# Altium schematic sheet Bioscope-Input-01.SchDoc
size 297 x 209 mm; SheetNumber: 1; SheetTotal: 1; ProjectTitle: Bioscope Input Stage; ProjectNumber: 01; Authors: Olivia De Vincenti; ProjectRevision: 01; SPICEModelCacheQIJVSJLZ: <root> / <DocumentId>QIJVSJLZ</DocumentId> / <CacheFrame Number="0"> / <Model Name="lm833" Kind="CKT"> / <Text>*LM833 OPERATIONAL AMPLIFIER "MACROMODEL" SUBCIRCUIT / * Connections: / *              Non-Inverting Input / *              | Inverting Input / *              | | Positive Power Supply / *              | | | Negative Power Supply / *              | | | | Output / *              | | | | | / .SUBCKT LM833  1 2 3 4 5 / C1   11 12 3.501E-12 / C2    6  7 10.00E-12 / DC    5 53 DX / DE   54  5 DX / DLP  90 91 DX / DLN  92 90 DX / DP    4  3 DX / EGND 99  0 POLY(2) (3,0) (4,0) 0 .5 .5 / FB    7 99 POLY(5) VB VC VE VLP VLN 0 27.96E6 / + -30E6 30E6 30E6 -30E6 / GA    6  0 11 12 565.5E-6 / GCM   0  6 10 99 5.655E-9 / ISS  10  4 DC 70.00E-6 / HLIM 90  0 VLIM 1K / J1   11  2 10 JX / J2   12  1 10 JX / R2    6  9 100.0E3 / RD1   3 11 1.768E3 / RD2   3 12 1.768E3 / RO1   8  5 10 / RO2   7 99 20 / RP    3  4 29.03E3 / RSS  10 99 2.857E6 / VB    9  0 DC 0 / VC    3 53 DC .9 / VE   54  4 DC .4 / VLIM  7  8 DC 0 / VLP  91  0 DC 30 / VLN   0 92 DC 30 / .MODEL DX D(IS=800.0E-18) / .MODEL JX NJF(IS=150.0E-9 BETA=4.568E-3 / + VTO=-1) / .ENDS LM833</Text> / </Model> / <Model Name="tl082" Kind="CKT"> / <Text>*TL082 / *Dual WideBW JFETInput OpAmp pkg:DIP8 (A:3,2,8,4,1)(B:5,6,8,4,7) / * Connections: / *             Non-Inverting Input / *             |   Inverting Input / *             |   |   Positive Power Supply / *             |   |   |   Negative Power Supply / *             |   |   |   |   Output / *             |   |   |   |   | / .SUBCKT TL082 1   2   3   4   5 / C1   11 12 3.498E-12 / C2    6  7 15E-12 / DC    5 53 DX / DE   54  5 DX / DLP  90 91 DX / DLN  92 90 DX / DP    4  3 DX / BGND 99  0 V=V(3)*.5 + V(4)*.5 / BB    7 99 I=I(VB)*4.715E6 - I(VC)*5E6 + I(VE)*5E6 + / +              I(VLP)*5E6 - I(VLN)*5E6 / GA    6  0 11 12 282.8E-6 / GCM   0  6 10 99 8.942E-9 / ISS   3 10 DC 195E-6 / HLIM 90  0 VLIM 1K / J1   11  2 10 JX / J2   12  1 10 JX / R2    6  9 100E3 / RD1   4 11 3.536E3 / RD2   4 12 3.536E3 / RO1   8  5 150 / RO2   7 99 150 / RP    3  4 2.143E3 / RSS  10 99 1.026E6 / VB    9  0 DC 0 / VC    3 53 DC 2.2 / VE   54  4 DC 2.2 / VLIM  7  8 DC 0 / VLP  91  0 DC 25 / VLN   0 92 DC 25 / .MODEL DX D(IS=800E-18) / .MODEL JX PJF(IS=15E-12 BETA=270.1E-6 VTO=-1) / .ENDS TL082</Text> / </Model> / </CacheFrame> / </root>
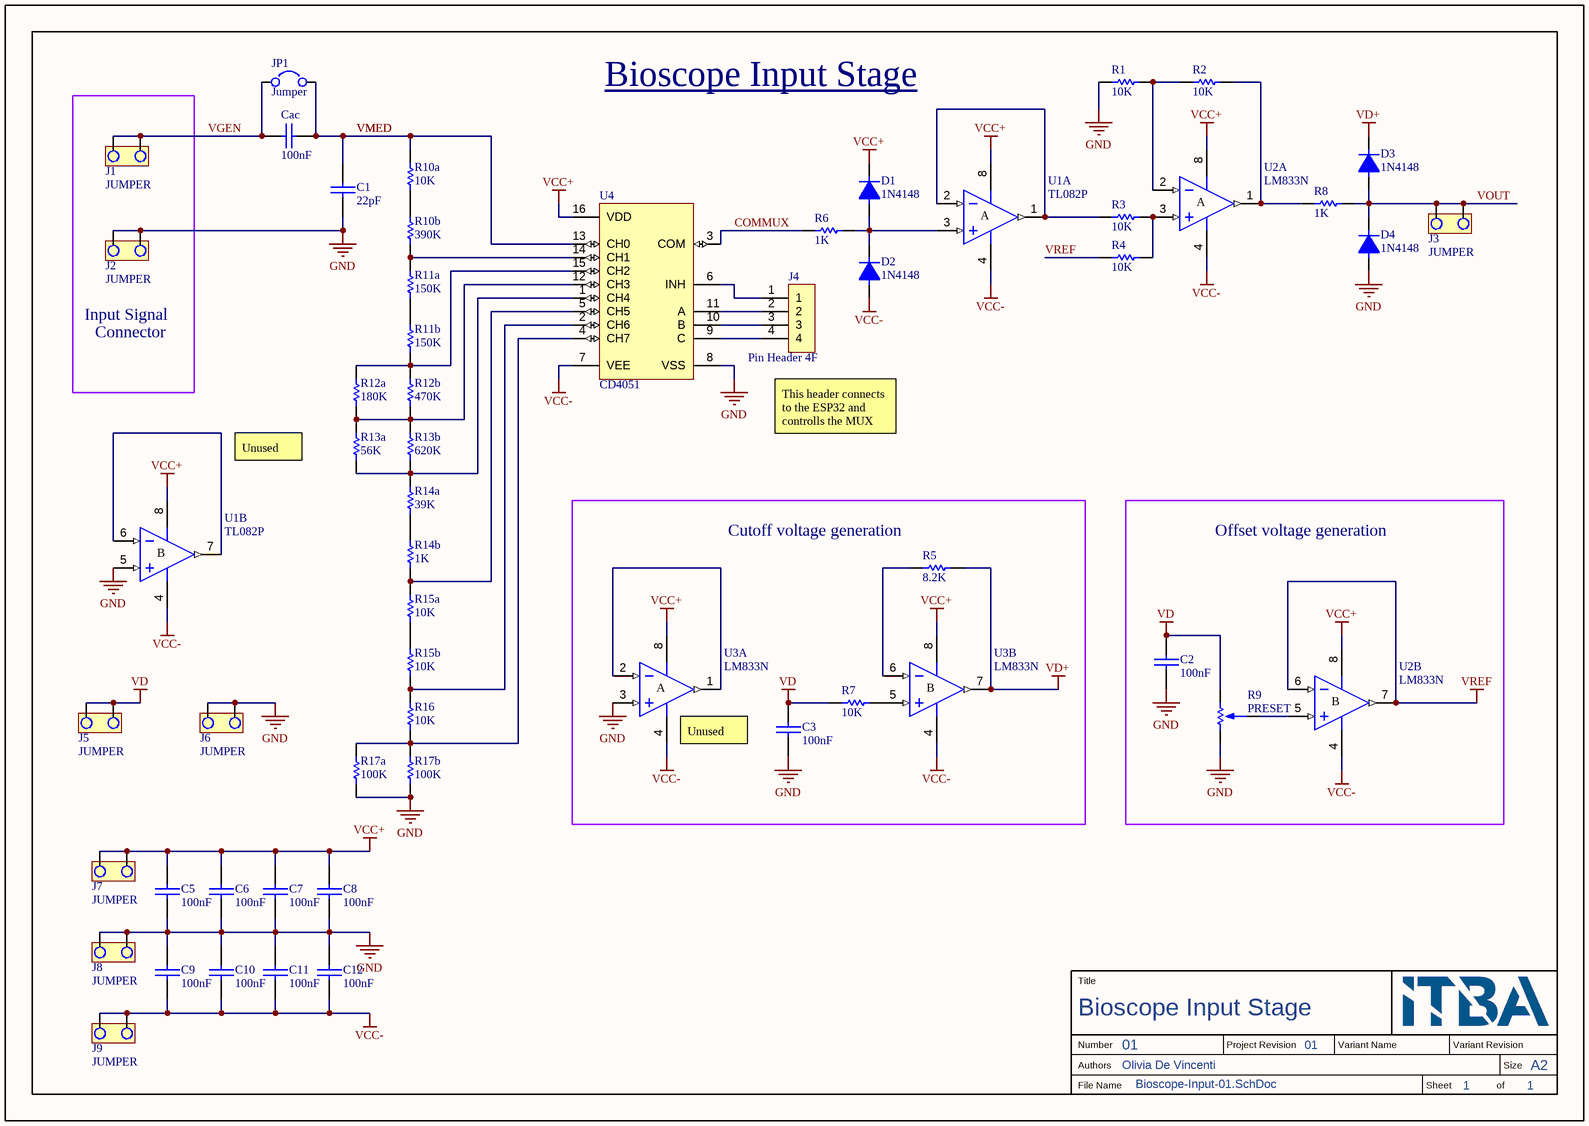
[diagram p0: Bioscope-Input-01.SchDoc]

## Parts
C1  22pF  [CAP100]
C2  100nF  [CAP100]
C3  100nF  [CAP200]
C5  100nF  [CAP100]
C6  100nF  [CAP100]
C7  100nF  [CAP100]
C8  100nF  [CAP100]
C9  100nF  [CAP100]
C10  100nF  [CAP200]
C11  100nF  [CAP100]
C12  100nF  [CAP100]
Cac  100nF  [CAP100]
D1  1N4148  [DO41]
D2  1N4148  [DO41]
D3  1N4148  [DO41]
D4  1N4148  [DO41]
J1  JUMPER  [JUMPER2]
J2  JUMPER  [JUMPER2]
J3  JUMPER  [JUMPER2]
J4  Pin Header 4F  [PINHEADER-4F]
J5  JUMPER  [JUMPER2]
J6  JUMPER  [JUMPER2]
J7  JUMPER  [JUMPER2]
J8  JUMPER  [JUMPER2]
J9  JUMPER  [JUMPER2]
JP1  Jumper  [JUMPER-HEADER]
R1  10K  [RES400]
R2  10K  [RES400]
R3  10K  [RES400]
R4  10K  [RES400]
R5  8.2K  [RES400]
R6  1K  [RES400]
R7  10K  [RES400]
R8  1K  [RES400]
R9  PRESET  [PRESET V]
R10a  10K  [RES400]
R10b  390K  [RES400]
R11a  150K  [RES400]
R11b  150K  [RES400]
R12a  180K  [RES400]
R12b  470K  [RES400]
R13a  56K  [RES400]
R13b  620K  [RES400]
R14a  39K  [RES400]
R14b  1K  [RES400]
R15a  10K  [RES400]
R15b  10K  [RES400]
R16  10K  [RES400]
R17a  100K  [RES400]
R17b  100K  [RES400]
U1  TL082P  [P008]  (parts A,B of 2)
U2  LM833N  [DIP8]  (parts A,B of 2)
U3  LM833N  [DIP8]  (parts A,B of 2)
U4  CD4051  [SOIC16]

## Blocks framed on the sheet
Cutoff voltage generation: C3 R5 R7 U3
Offset voltage generation: C2 R9 U2

## Nets
GND: C1.2 C2.2 C3.2 C5.2 C6.2 C7.2 C8.2 C9.1 C10.1 C11.1 C12.1 D4.1 J2.1 J2.2 J6.1 J6.2 J8.1 J8.2 R1.1 R9.3 R17a.1 R17b.1 U1.5(IN+) U3.3(IN+) U4.8(VSS)
VCC+: C5.1 C6.1 C7.1 C8.1 D1.2 J7.1 J7.2 U1.8(V+) U2.8(V+) U3.8(V+) U4.16(VDD)
VCC-: C9.2 C10.2 C11.2 C12.2 D2.1 J9.1 J9.2 U1.4(V-) U2.4(V-) U3.4(V-) U4.7(VEE)
VD: C2.1 C3.1 J5.1 J5.2 R7.1 R9.1
VD+: D3.2 R5.2 U3.7(OUT)
VREF: R4.1 U2.6(IN-) U2.7(OUT)
COMMUX: R6.1 U4.3(COM)
VGEN: Cac.1 J1.1 J1.2 JP1.1
VMED: C1.1 Cac.2 JP1.2 R10a.2 U4.13(CH0)
VOUT: D3.1 D4.2 J3.1 J3.2 R8.2
NetD1_1: D1.1 D2.2 R6.2 U1.3(IN+)
NetJ4_1: J4.1 U4.6(INH)
NetJ4_2: J4.2 U4.11(A)
NetJ4_3: J4.3 U4.10(B)
NetJ4_4: J4.4 U4.9(C)
NetR1_2: R1.2 R2.1 U2.2(IN-)
NetR2_2: R2.2 R8.1 U2.1(OUT)
NetR3_1: R3.1 U1.1(OUT) U1.2(IN-)
NetR3_2: R3.2 R4.2 U2.3(IN+)
NetR5_1: R5.1 U3.6(IN-)
NetR7_2: R7.2 U3.5(IN+)
NetR9_2: R9.2 U2.5(IN+)
NetR10a_1: R10a.1 R10b.2
NetR10b_1: R10b.1 R11a.2 U4.14(CH1)
NetR11a_1: R11a.1 R11b.2
NetR11b_1: R11b.1 R12a.2 R12b.2 U4.15(CH2)
NetR12a_1: R12a.1 R12b.1 R13a.2 R13b.2 U4.12(CH3)
NetR13a_1: R13a.1 R13b.1 R14a.2 U4.1(CH4)
NetR14a_1: R14a.1 R14b.2
NetR14b_1: R14b.1 R15a.2 U4.5(CH5)
NetR15a_1: R15a.1 R15b.2
NetR15b_1: R15b.1 R16.2 U4.2(CH6)
NetR16_1: R16.1 R17a.2 R17b.2 U4.4(CH7)
NetU1_6: U1.6(IN-) U1.7(OUT)
NetU3_1: U3.1(OUT) U3.2(IN-)

## Notes on the sheet
- Bioscope Input Stage
- Input Signal
- Connector
- Unused
- (near J4) This header connects to the ESP32 and controlls the MUX
- (near U3) Unused
- Title
- File Name
- Number
- Authors
- Project Revision
- Variant Name
- Sheet
- Variant Revision
- of
- Size
- A2
- (in symbol LM833N, part A) A
- (in symbol LM833N, part B) B
- (in symbol TL082P, part A) A
- (in symbol TL082P, part B) B

## Library data of the parts
C1-C3 C5-C12 Cac = CAP
D1-D4 = DIODO
J4 = PINHEADER-4F: Pin Header, Female, 4 positions
JP1 = Jumper Header: 2.54mm 2 pin header and jumper
R1-R8 R10a R10b R11a R11b R12a R12b R13a R13b R14a R14b R15a R15b R16 R17a R17b = RES
U1 = TL082P: JFET-Input Operational Amplifier; Published: 16-Jan-2001; LatestRevisionDate: 04-Mar-2005; LatestRevisionNote: Stylized 3D Model Added.; DatasheetVersion: Feb-1999; PackageVersion: Jun-1999; PackageReference: P008; Publisher: Altium Limited; PackageDescription: DIP; 8 Leads; Row Spacing 7.62 mm; Pitch 2.54 mm; Code_JEDEC: MO-001-AN; ComponentLink1Description: Manufacturer Link; ComponentLink1URL: http://www.ti.com/; ComponentLink2Description: Datasheet; ComponentLink2URL: http://www-s.ti.com/sc/ds/tl082.pdf
U2 U3 = LM833N: Low-Noise Dual Operational Amplifier; Published: 24-Aug-2001; LatestRevisionDate: 06-Jun-2005; LatestRevisionNote: Stylized 3D Model Added.; DatasheetVersion: Dec-1997; PackageReference: DIP8; Publisher: Altium Limited; PackageDescription: DIP; 8 Leads; Row Spacing 7.62 mm; Pitch 2.54 mm; Code_JEDEC: MO-001-AN; ComponentLink1Description: Manufacturer Link; ComponentLink1URL: http://www.st.com/; ComponentLink2Description: Datasheet; ComponentLink2URL: http://www.st.com/stonline/products/literature/ds/2169/lm833.pdf
U4 = CD4051BF: Single 8-Channel Analog Multiplexer or Demultiplexer; Mfr_Name: Texas Instruments; RefDes: RefDes; Type: Type